# EAGLE design RKJXM1 Breakout Output Pins v14 (EAGLE 9.6.2)
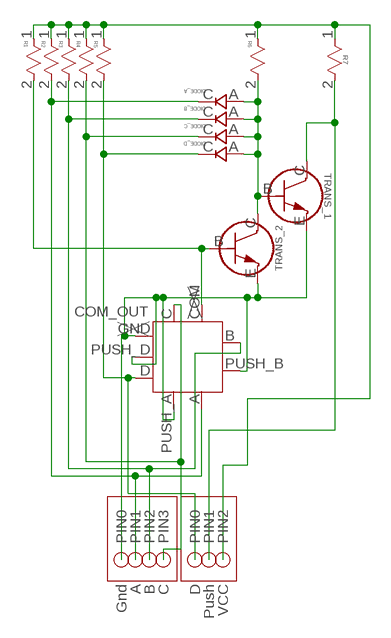
[diagram p0: schematic, sheet 1]

## Parts
DIODE_A  DIODE_SCHOTTKY_SMD_USC_TOS  [DIODE_SCHOTTKY_SMD_USC_TOS]
DIODE_B  DIODE_SCHOTTKY_SMD_USC_TOS  [DIODE_SCHOTTKY_SMD_USC_TOS]
DIODE_C  DIODE_SCHOTTKY_SMD_USC_TOS  [DIODE_SCHOTTKY_SMD_USC_TOS]
DIODE_D  DIODE_SCHOTTKY_SMD_USC_TOS  [DIODE_SCHOTTKY_SMD_USC_TOS]
R1  RESISTOR_1K_SMD_RNCP0805FTD1K00STA_RNCP0805_STP-L  [STA_RNCP0805_STP-L]
R2  RESISTOR_1K_SMD_RNCP0805FTD1K00STA_RNCP0805_STP-L  [STA_RNCP0805_STP-L]
R3  RESISTOR_1K_SMD_RNCP0805FTD1K00STA_RNCP0805_STP-L  [STA_RNCP0805_STP-L]
R4  RESISTOR_1K_SMD_RNCP0805FTD1K00STA_RNCP0805_STP-L  [STA_RNCP0805_STP-L]
R5  RESISTOR_1K_SMD_RNCP0805FTD1K00STA_RNCP0805_STP-L  [STA_RNCP0805_STP-L]
R6  RESISTOR_1K_SMD_RNCP0805FTD1K00STA_RNCP0805_STP-L  [STA_RNCP0805_STP-L]
R7  RESISTOR_1K_SMD_RNCP0805FTD1K00STA_RNCP0805_STP-L  [STA_RNCP0805_STP-L]
RKJXM1_SWITCH  RKJXM1_V3  [RKJXM1_FOOT_V3]
TRANS_1  TRANS_NPN_SMD_MMBT3904-TPSOT-23_MCC-L  [SOT-23_MCC-L]
TRANS_2  TRANS_NPN_SMD_MMBT3904-TPSOT-23_MCC-L  [SOT-23_MCC-L]
U$3  JST_ZH_4PIN  [JST_ZH_4PIN]
U$4  JST_ZH_3PIN_NO_GND  [JST_ZH_3PIN_NO_GND]

## Nets
A_OUT: DIODE_A.C R2.2 RKJXM1_SWITCH.A U$3.PIN1
B_OUT: DIODE_B.C R3.2 RKJXM1_SWITCH.B U$3.PIN2
C_OUT: DIODE_C.C R4.2 RKJXM1_SWITCH.C U$3.PIN3
D_OUT: DIODE_D.C R5.2 RKJXM1_SWITCH.D U$4.PIN0
GROUND_OUT: RKJXM1_SWITCH.GND RKJXM1_SWITCH.PUSH_A RKJXM1_SWITCH.PUSH_B RKJXM1_SWITCH.PUSH_D TRANS_1.E TRANS_2.E U$3.PIN0
N$6: R1.2 RKJXM1_SWITCH.COM TRANS_2.B
N$8: DIODE_A.A DIODE_B.A DIODE_C.A DIODE_D.A R6.2 TRANS_1.B TRANS_2.C
PUSH_OUT: R7.2 TRANS_1.C U$4.PIN1
VCC_OUT: R1.1 R2.1 R3.1 R4.1 R5.1 R6.1 R7.1 U$4.PIN2

## Notes on the sheet
- COM_OUT
- Gnd | A | B | C | D | Push | VCC

## Library data of the parts
DIODE_A DIODE_B DIODE_C DIODE_D = Created Parts:DIODE_SCHOTTKY_SMD_USC_TOS
R1-R7 = Created Parts:RESISTOR_1K_SMD_RNCP0805FTD1K00; BUILT_BY: EMA_UL_Team; MANUFACTURER_PART_NUMBER: RNCP0805FTD1K00; RESISTANCE: 1K; SOURCELIBRARY: Stackpole_2014-12-31; VENDOR: Stackpole International
RKJXM1_SWITCH = Created Parts:RKJXM1_V3; PART_NAME: RKJXM1_Switch
TRANS_1 TRANS_2 = Created Parts:TRANS_NPN_SMD_MMBT3904-TP; BUILT_BY: EMA_Cory; COPYRIGHT: Copyright (C) 2018 Accelerated Designs. All rights reserved; MANUFACTURER_PART_NUMBER: MMBT3904-TP; SOURCELIBRARY: MCC_2019-12-03; VENDOR: Micro Commercial Co
U$3 = Created Parts:JST_ZH_4PIN; LABEL: 4-Pin; PIN0: Gnd; PIN1: A; PIN2: B; PIN3: C
U$4 = Created Parts:JST_ZH_3PIN_NO_GND; LABEL: 3-Pin; PIN0: D; PIN1: Push; PIN2: Vcc

## Board
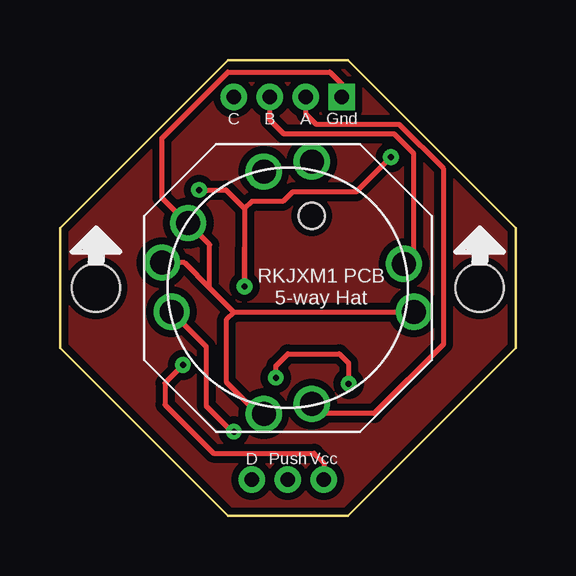
[diagram p1: board, top side]
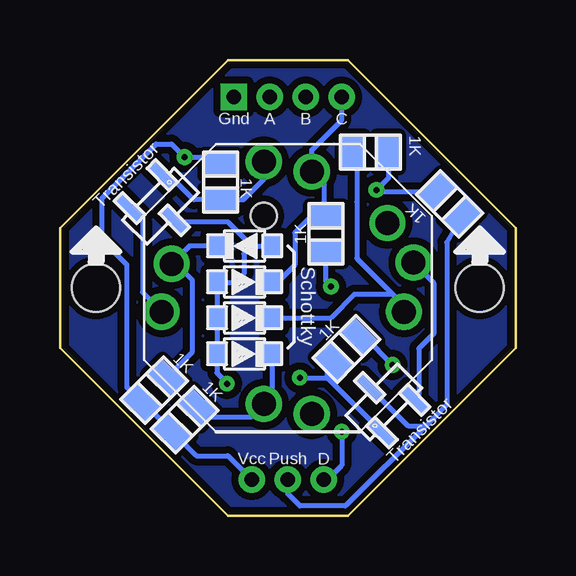
[diagram p2: board, bottom side, seen from below]

Size 19 x 19 mm. Coordinates in mm from the lower left corner, seen from the top.
Outline: 19,12 19,7 12,0 7,0 0,7 0,12 7,19 12,19 19,12
Copper layers (1*16): Top 0.035mm / dielectric 1.5mm / Bottom 0.035mm
Design rules ".20mm switch pcb": minimum track width 0.2mm, minimum drill 0.15mm, track to track 0.2mm, track to pad 0.2mm, pad to pad 0.2mm, via to via 0.2mm, smd to smd 0.2mm, copper to edge 0.2mm, drill to drill 0.2mm, minimum pad ring 10mil, minimum via ring 8mil, stop-mask expansion 4mil, vias tented up to drill 0mil, thermal gap 10mil
Holes 2 mm at 17.5,9.5 1.5,9.5

### Footprints (pad centres in the part's own frame; a part is rotated, then mirrored left to right if it is on the bottom)
DIODE_SCHOTTKY_SMD_USC_TOS = smd 0.8 x 0.9: A -1.15,0; C 1.15,0
STA_RNCP0805_STP-L = smd 0.913 x 1.347: 1 -0.723,0; 2 0.723,0
RKJXM1_FOOT_V3 = drill 1: A 1,-4.848; C -1,4.848; COM 1,5.256; D -4.848,-1; PUSH_A -1,-5.256; PUSH_B 5.256,-1; PUSH_D -5.246,1.05 | drill 1 pad 1.5: B 4.848,1; GND -4.15,2.698 | hole 1.1: 1,3
SOT-23_MCC-L = smd 0.528 x 1.289: B -0.959,-0.826; C 0,0.826; E 0.959,-0.826
JST_ZH_4PIN = drill 0.6 square: PIN0 -2.25,0 | drill 0.6: PIN1 -0.75,0; PIN2 0.75,0; PIN3 2.25,0
JST_ZH_3PIN_NO_GND = drill 0.6: PIN0 -1.5,0; PIN1 0,0; PIN2 1.5,0

### Placement (x,y rotation side)
DIODE_A  11.3,6.75 0 bottom
DIODE_B  11.3,11.25 180 bottom
DIODE_C  11.3,9.75 0 bottom
DIODE_D  11.3,8.25 0 bottom
R1  12.3,13.9 270 bottom
R2  13.8,4 45 bottom
R3  15.07,5.23 45 bottom
R4  7.9,11.75 90 bottom
R5  6.05,15.16 180 bottom
R6  7.05,6.95 225 bottom
R7  2.75,13 315 bottom
RKJXM1_SWITCH  9.5,9.5 0 top
TRANS_1  5.5,4.75 45 bottom
TRANS_2  14.8,12.9 225 bottom
U$3  9.5,17.45 0 bottom
U$4  9.5,1.5 180 bottom

### Tracks (layer width: path | path; a pad name or v marks a point on that pad's centre or on a via)
A_OUT
  Top 0.2: RKJXM1_SWITCH.A 10.9,4.25 13.1,4.25 16,7.15 16,14.46 14.15,16.31 10.69,16.31 10.25,16.75 U$3.PIN1
  Bottom 0.2: R2.2 12.89,4.11 11.04,4.11 RKJXM1_SWITCH.A 10.15,5 DIODE_A.C
B_OUT
  Top 0.2: RKJXM1_SWITCH.B 14.75,10.9 14.75,15.1 13.94,15.91 9.34,15.91 8.75,16.5 U$3.PIN2
  Bottom 0.2: DIODE_B.C 13.6,11.25 RKJXM1_SWITCH.B 14.15,10.5 13.5,9.85 13.5,6.8 R3.2
C_OUT
  Bottom 0.2: DIODE_C.C 9.97,9.68 9.2,10.45 9.2,11.8 8.53,12.47 8,12.47 | 8,12.47 R4.2 | 8,12.47 8,13.85 RKJXM1_SWITCH.C 8.5,15.25 7.25,16.5 U$3.PIN3
D_OUT  (via drill 0.25)
  Top 0.2: RKJXM1_SWITCH.D 6.1,7.05 6.1,4.58 7.18,3.5 v7.25,3.5
  Bottom 0.2: RKJXM1_SWITCH.D 4.65,8.75 5.13,9.23 | 5.13,9.23 6.72,9.23 7.7,8.25 DIODE_D.C | 5.13,9.23 6.62,10.72 6.62,13.08 6.62,15.16 R5.2 | v7.25,3.5 7.25,2.1 7.85,1.5 U$4.PIN0
GND
  pour Top (isolate 0.3): 0,12 7,19 12,19 19,12 19,7 12,0 7,0 0,7
  pour Bottom (isolate 0.3): 0,12 7,19 12,19 19,12 19,7 12,0 7,0 0,7
GROUND_OUT
  Top 0.2: RKJXM1_SWITCH.PUSH_A 8.25,4.24 6.95,5.54 6.95,8.19 7.25,8.5 | 7.25,8.5 6.25,9.5 | 7.25,8.5 RKJXM1_SWITCH.PUSH_B | 6.25,9.5 5.19,10.55 RKJXM1_SWITCH.PUSH_D | 6.25,9.5 6.25,11.3 RKJXM1_SWITCH.GND 5.3,12.2 4.25,13.25 4.25,15.75 7,18.5 11.25,18.5 11.75,18 U$3.PIN0
  Bottom 0.2: RKJXM1_SWITCH.PUSH_D 3.41,9.71 3.41,7.59 4.04,6.96 4.04,5.04 TRANS_1.E | TRANS_2.E 15.56,12.31 15.56,9.31 RKJXM1_SWITCH.PUSH_B
N$6
  Bottom 0.2: RKJXM1_SWITCH.COM 10.5,14.03 11.35,13.18 R1.2 13.43,13.18 14.41,14.16 TRANS_2.B
N$8  (via drill 0.25)
  Top 0.2: v9,5.75 9,6.25 9.5,6.75 11.65,6.75 12.04,6.36 v12.04,5.5
  Bottom 0.2: TRANS_1.B 7.84,5.75 | TRANS_2.C 14.07,12.18 14,12.25 12,12.25 11,11.25 | v12.04,5.5 12.04,5.54 12.45,5.95 DIODE_A.A DIODE_D.A 12.45,9.7 | v9,5.75 7.84,5.75 | 7.84,5.75 7.84,6.16 R6.2 | 11,11.25 DIODE_B.A | 11,11.25 11.32,10.93 11.32,10.07 11.7,9.7 12.45,9.7 | 12.45,9.8 DIODE_C.A 12.45,9.7
PUSH_OUT
  Bottom 0.2: R7.2 2.87,11.4 2.87,4.63 3.75,3.75 | 3.75,3.75 4.5,3.75 TRANS_1.C | 3.75,3.75 7.1,0.4 9,0.4 9.5,0.9 U$4.PIN1
VCC_OUT  (via drill 0.25)
  Top 0.2: 7.7,12.8 6.92,13.58 v5.8,13.58 | 7.7,12.8 v7.7,9.55 7.7,11.2 | v5.13,6.28 4.38,5.53 4.38,4.62 6.4,2.6 10.6,2.6 11,2.2 U$4.PIN2 | v13.8,14.95 12.35,13.5 9.7,13.5 9.3,13.1 8,13.1 7.7,12.8
  Bottom 0.2: R1.1 12.3,14.64 12.61,14.95 v13.8,14.95 14.35,15.5 15,15.5 17.25,13.25 17.25,11.5 16.2,10.45 16.2,5.34 R3.1 15.54,4.72 R2.1 13.32,2.5 12,2.5 U$4.PIN2 | v7.7,9.55 7.9,9.75 R4.1 | R6.1 6.31,7.46 v5.13,6.28 | R5.1 5.3,15.13 5.3,14.08 v5.8,13.58 5.74,13.52 3.28,13.52 R7.1

### Text on the board
tPlace: Gnd | RKJXM1 PCB / 5-way Hat
bPlace: Transistor | Schottky | Transistor